# EAGLE schematic PCB111000_1_V2_CC (EAGLE 9.6.2)
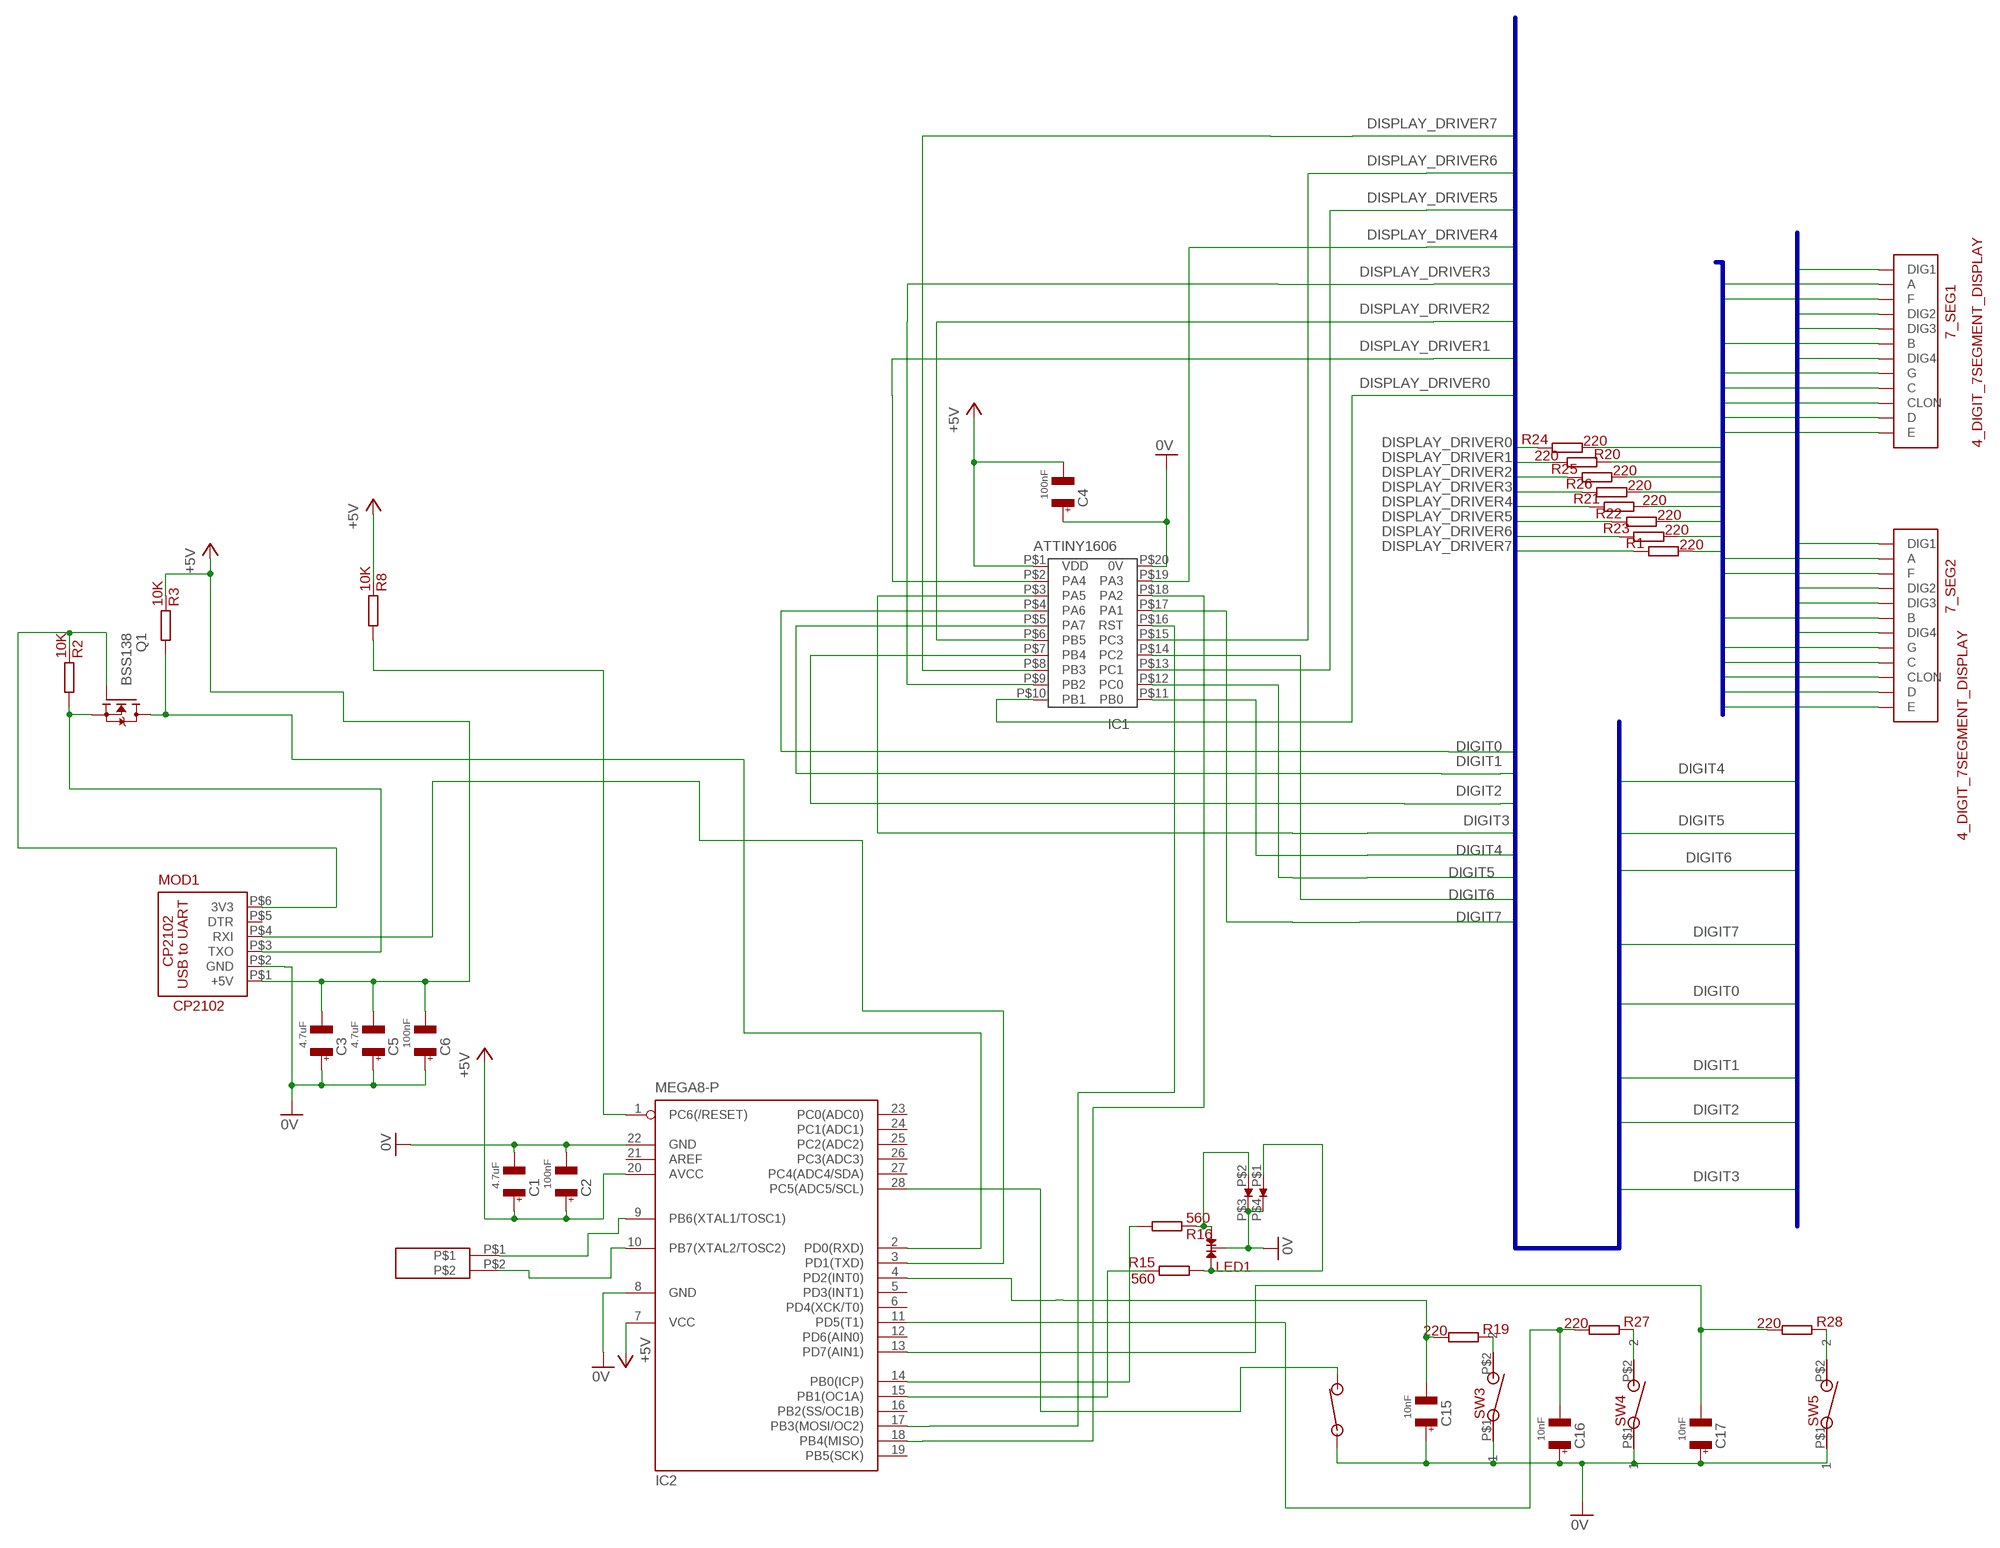
[diagram p0: schematic, sheet 1]

## Parts
7_SEG1  4_DIGIT_7SEGMENT_DISPLAY  [4_DIGIT_7SEGMENT_DISPLAY]
7_SEG2  4_DIGIT_7SEGMENT_DISPLAY  [4_DIGIT_7SEGMENT_DISPLAY]
C1  4.7uF  1206C  [1206@1]
C2  100nF  1206C  [1206@1]
C3  4.7uF  1206C  [1206@1]
C4  100nF  1206C  [1206@1]
C5  4.7uF  1206C  [1206@1]
C6  100nF  1206C  [1206@1]
C15  10nF  1206C  [1206@1]
C16  10nF  1206C  [1206@1]
C17  10nF  1206C  [1206@1]
IC1  ATTINY1606  [ATTINY1606]
IC2  MEGA8-P  [DIL28-3]
LED1  LED  [CA_DUAL_LED]
MOD1  CP2102  [CP2102]
Q1  BSS138  [SOT23]
R1  220  1206R  [1206@1]
R2  10K  1206R  [1206@1]
R3  10K  1206R  [1206@1]
R8  10K  1206R  [1206@1]
R15  560  1206R  [1206@1]
R16  560  1206R  [1206@1]
R19  220  1206R  [1206@1]
R20  220  1206R  [1206@1]
R21  220  1206R  [1206@1]
R22  220  1206R  [1206@1]
R23  220  1206R  [1206@1]
R24  220  1206R  [1206@1]
R25  220  1206R  [1206@1]
R26  220  1206R  [1206@1]
R27  220  1206R  [1206@1]
R28  220  1206R  [1206@1]
SW1  NO_SW  [SM_NO_PUSH_BUTTON]
SW3  NO_PB_1  [RE51-0711]
SW4  NO_PB_1  [RE51-0711]
SW5  NO_PB_1  [RE51-0711]
U$1  XTAL  [XTAL]
U$2  DUAL_SM_LED  [SM_DUAL_LED]

## Nets
0V: C1.P$2 C2.P$2 C3.P$1 C4.P$1 C5.P$1 C6.P$1 C15.P$1 C16.P$1 C17.P$1 IC1.P$20(0V) IC2.8(GND) IC2.22(GND) LED1.2 MOD1.P$2(GND) SW1.P$1 SW3.P$1 SW4.P$1 SW5.P$1 U$2.P$3 U$2.P$4
+5V: C1.P$1 C2.P$1 C3.P$2 C4.P$2 C5.P$2 C6.P$2 IC1.P$1(VDD) IC2.7(VCC) IC2.20(AVCC) MOD1.P$1(+5V) R3.P$2 R8.P$2
DIGIT0: 7_SEG1.P$12(DIG1) IC1.P$4(PA6)
DIGIT1: 7_SEG1.P$9(DIG2) IC1.P$5(PA7)
DIGIT2: 7_SEG1.P$8(DIG3) IC1.P$7(PB4)
DIGIT3: 7_SEG1.P$6(DIG4) IC1.P$3(PA5)
DIGIT4: 7_SEG2.P$12(DIG1) IC1.P$11(PB0)
DIGIT5: 7_SEG2.P$9(DIG2) IC1.P$12(PC0)
DIGIT6: 7_SEG2.P$8(DIG3) IC1.P$14(PC2)
DIGIT7: 7_SEG2.P$6(DIG4) IC1.P$17(PA1)
DISPLAY_DRIVER0: IC1.P$10(PB1) R24.P$2
DISPLAY_DRIVER1: IC1.P$2(PA4) R20.P$1
DISPLAY_DRIVER2: IC1.P$6(PB5) R25.P$2
DISPLAY_DRIVER3: IC1.P$9(PB2) R26.P$2
DISPLAY_DRIVER4: IC1.P$19(PA3) R21.P$2
DISPLAY_DRIVER5: IC1.P$13(PC1) R22.P$2
DISPLAY_DRIVER6: IC1.P$15(PC3) R23.P$2
DISPLAY_DRIVER7: IC1.P$8(PB3) R1.P$2
N$1: IC2.14(PB0(ICP)) R16.P$1
N$2: IC2.15(PB1(OC1A)) R15.P$2
N$3: LED1.1 R15.P$1 U$2.P$1
N$4: LED1.3 R16.P$2 U$2.P$2
N$5: IC2.28(PC5(ADC5/SCL)) SW1.P$2
N$6: IC1.P$16(RST) IC2.17(PB3(MOSI/OC2))
N$7: R27.P$2 SW4.P$2
N$8: R19.P$2 SW3.P$2
N$9: C15.P$2 IC2.4(PD2(INT0)) R19.P$1
N$10: IC1.P$18(PA2) IC2.18(PB4(MISO))
N$11: C17.P$2 IC2.13(PD7(AIN1)) R28.P$1
N$12: IC2.9(PB6(XTAL1/TOSC1)) U$1.P$1
N$13: IC2.1(PC6(/RESET)) R8.P$1
N$14: IC2.3(PD1(TXD)) MOD1.P$4(RXI)
N$15: MOD1.P$3(TXO) Q1.2(S) R2.P$1
N$16: R28.P$2 SW5.P$2
N$17: IC2.10(PB7(XTAL2/TOSC2)) U$1.P$2
N$18: MOD1.P$6(3V3) Q1.1(G) R2.P$2
N$19: C16.P$2 IC2.11(PD5(T1)) R27.P$1
N$40: IC2.2(PD0(RXD)) Q1.3(D) R3.P$1
SEVEN_SEG0: 7_SEG1.P$11(A) 7_SEG2.P$11(A) R24.P$1
SEVEN_SEG1: 7_SEG1.P$7(B) 7_SEG2.P$7(B) R20.P$2
SEVEN_SEG2: 7_SEG1.P$4(C) 7_SEG2.P$4(C) R25.P$1
SEVEN_SEG3: 7_SEG1.P$2(D) 7_SEG2.P$2(D) R26.P$1
SEVEN_SEG4: 7_SEG1.P$1(E) 7_SEG2.P$1(E) R21.P$1
SEVEN_SEG5: 7_SEG1.P$10(F) 7_SEG2.P$10(F) R22.P$1
SEVEN_SEG6: 7_SEG1.P$5(G) 7_SEG2.P$5(G) R23.P$1
SEVEN_SEG7: 7_SEG1.P$3(CLON) 7_SEG2.P$3(CLON) R1.P$1
Unconnected: IC2.5(PD3(INT1)) IC2.6(PD4(XCK/T0)) IC2.12(PD6(AIN0)) IC2.16(PB2(SS/OC1B)) IC2.19(PB5(SCK)) IC2.21(AREF) IC2.23(PC0(ADC0)) IC2.24(PC1(ADC1)) IC2.25(PC2(ADC2)) IC2.26(PC3(ADC3)) IC2.27(PC4(ADC4/SDA)) MOD1.P$5(DTR)

## Buses
SEVEN_SEG[0..7]
DIGIT0,DIGIT1,DIGIT2,DIGIT3,DIGIT4,DIGIT5,DIGIT6,DIGIT7,DISPLAY_DRIVER[0..7]
DIGIT[0..7],DIGIT3,DIGIT5

## Library data of the parts
7_SEG1 7_SEG2 = 1_marko:4_DIGIT_7SEGMENT_DISPLAY: Common Anode RE 55-1674
C1-C6 C15-C17 = 1_Home_library:1206C: 4.7uF RS 538-2335 100nF RS 264-4179
IC1 = home_library:ATTINY1606
IC2 = 1_Home_library:MEGA8-P: MICROCONTROLLER 8 Kbytes FLASH, 1 kbytes SRAM, 512 bytes EEPROM, USART, 4-channel 10 bit ADC, 2-channel 8 bit ADC Pin compatible with Atmega48, ATMega88, ATMega168 Source: avr.lbr; OC_FARNELL: unknown; OC_NEWARK: unknown
LED1 = 3_My_prog:LED: RS228-5770
MOD1 = home_library:CP2102
Q1 = home_library:BSS138
R1-R3 R8 R15 R16 R19-R28 = 1_Home_library:1206R
SW1 = 1_Home_library:NO_SW: SM NO push button RE 51-0709
SW3-SW5 = 1_3V3_Bootloader:NO_PB_1: RE 51-0711
U$1 = mo:XTAL
U$2 = home_library:DUAL_SM_LED: RS 174-9789